# EAGLE schematic Boat (EAGLE 9.2.2)
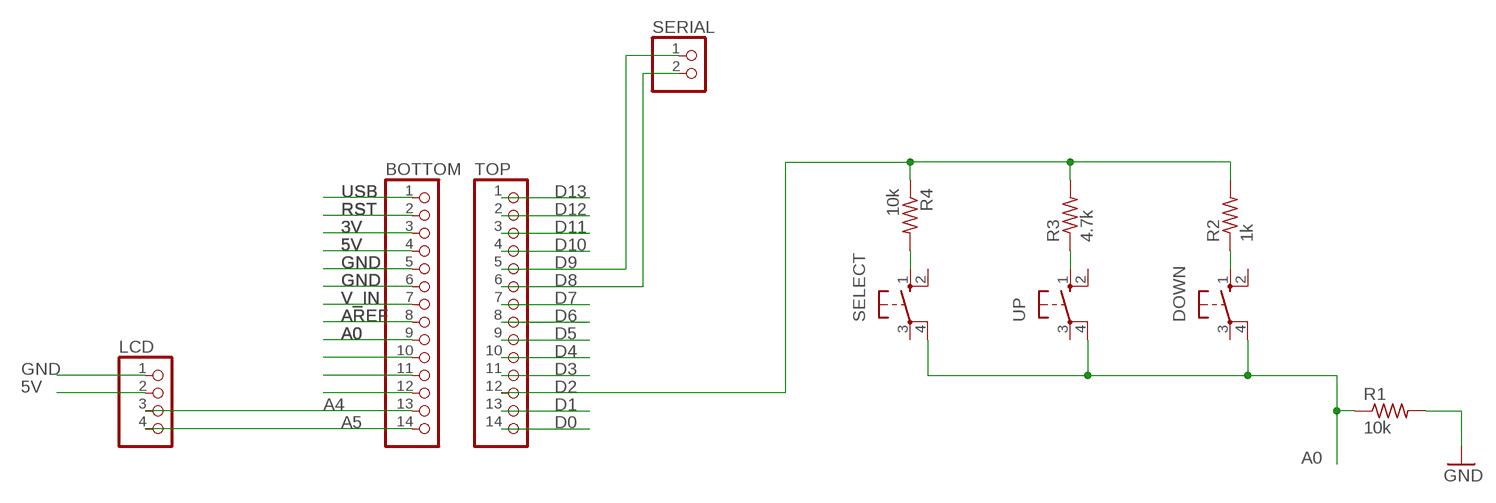
[diagram p0: schematic, sheet 1]

## Parts
BOTTOM  PINHD-1X14  [1X14]
DOWN  10-XX  [B3F-10XX]
LCD  PINHD-1X4  [1X04]
R1  10k  R-US_0204/7  [0204/7]
R2  1k  R-US_0204/7  [0204/7]
R3  4.7k  R-US_0204/7  [0204/7]
R4  10k  R-US_0204/7  [0204/7]
SELECT  10-XX  [B3F-10XX]
SERIAL  PINHD-1X2  [1X02]
TOP  PINHD-1X14  [1X14]
UP  10-XX  [B3F-10XX]

## Nets
3V: BOTTOM.3
5V: BOTTOM.4 LCD.2
A0: BOTTOM.9 DOWN.4(P1) R1.1 SELECT.4(P1) UP.4(P1)
A4: BOTTOM.13 LCD.3
A5: BOTTOM.14 LCD.4
AREF: BOTTOM.8
D0: TOP.14
D1: TOP.13
D2: R2.2 R3.2 R4.1 TOP.12
D3: TOP.11
D4: TOP.10
D5: TOP.9
D6: TOP.8
D7: TOP.7
D8: SERIAL.2 TOP.6
D9: SERIAL.1 TOP.5
D10: TOP.4
D11: TOP.3
D12: TOP.2
D13: TOP.1
GND: BOTTOM.5 BOTTOM.6 LCD.1 R1.2
N$1: R4.2 SELECT.1(S)
N$2: R3.1 UP.1(S)
N$3: DOWN.1(S) R2.1
N$5: BOTTOM.12
N$6: BOTTOM.11
N$7: BOTTOM.10
RST: BOTTOM.2
USB: BOTTOM.1
V_IN: BOTTOM.7
Unconnected: DOWN.2(S1) DOWN.3(P) SELECT.2(S1) SELECT.3(P) UP.2(S1) UP.3(P)

## Library data of the parts
BOTTOM TOP = pinhead:PINHD-1X14: PIN HEADER
DOWN SELECT UP = switch-omron:10-XX: OMRON SWITCH; MPN: B3F-1000; OC_FARNELL: 176432; OC_NEWARK: 36M3542
LCD = pinhead:PINHD-1X4: PIN HEADER
R1-R4 = resistor:R-US_: RESISTOR, American symbol
SERIAL = pinhead:PINHD-1X2: PIN HEADER